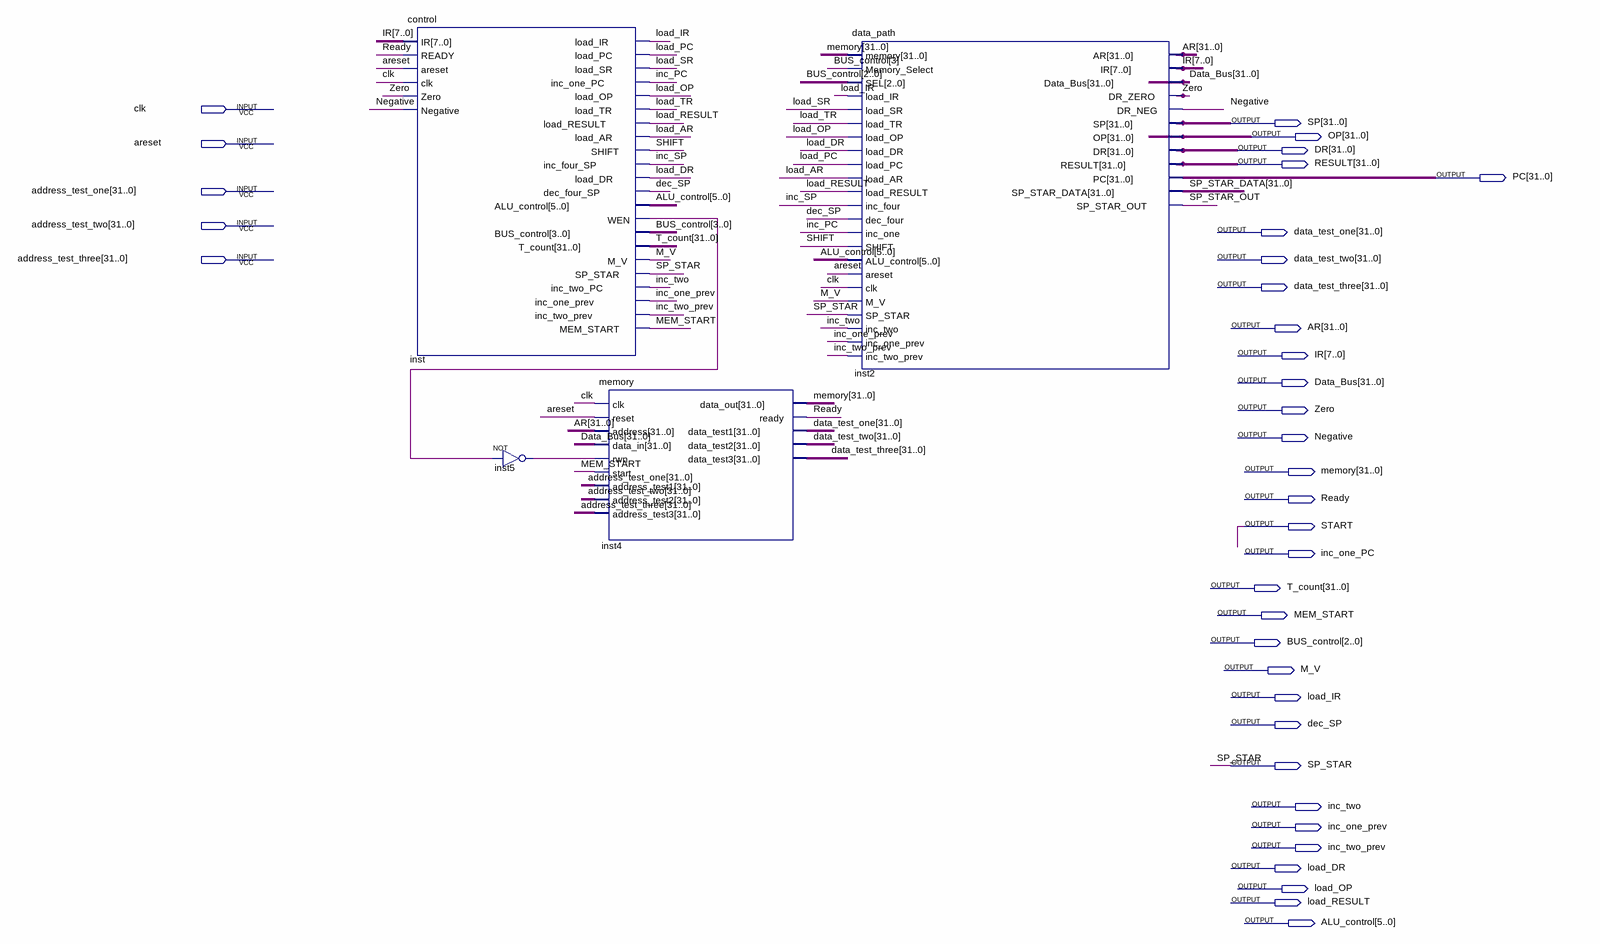
[diagram p0: schematic sheet]
// Quartus schematic CPU.bdf as structural Verilog: 4 symbols, 36 pins
module CPU (
  input  clk,
  input  areset,
  input  [31:0] address_test_one,
  input  [31:0] address_test_two,
  input  [31:0] address_test_three,
  output [31:0] SP,
  output [31:0] OP,
  output [31:0] DR,
  output [31:0] RESULT,
  output [31:0] PC,
  output [31:0] data_test_one,
  output [31:0] data_test_two,
  output [31:0] data_test_three,
  output [31:0] AR,
  output [7:0] IR,
  output [31:0] Data_Bus,
  output Zero,
  output Negative,
  output [31:0] memory,
  output Ready,
  output START,
  output inc_one_PC,
  output [31:0] T_count,
  output MEM_START,
  output [3:0] BUS_control,
  output M_V,
  output load_IR,
  output dec_SP,
  output SP_STAR,
  output inc_two,
  output inc_one_prev,
  output inc_two_prev,
  output load_DR,
  output load_OP,
  output load_RESULT,
  output [5:0] ALU_control
);

  wire inc_PC, inc_SP, inst5_out, inst_wen, load_AR, load_PC, load_SR, load_TR, SHIFT, SP_STAR_OUT;
  wire [31:0] SP_STAR_DATA;

  control inst (
    .IR(IR), .READY(Ready), .areset(areset), .clk(clk), .Zero(Zero), .Negative(Negative), .load_IR(load_IR),
    .load_PC(load_PC), .load_SR(load_SR), .inc_one_PC(inc_PC), .load_OP(load_OP), .load_TR(load_TR),
    .load_RESULT(load_RESULT), .load_AR(load_AR), .SHIFT(SHIFT), .inc_four_SP(inc_SP), .load_DR(load_DR),
    .dec_four_SP(dec_SP), .ALU_control(ALU_control), .WEN(inst_wen), .BUS_control(BUS_control),
    .T_count(T_count), .M_V(M_V), .SP_STAR(SP_STAR), .inc_two_PC(inc_two), .inc_one_prev(inc_one_prev),
    .inc_two_prev(inc_two_prev), .MEM_START(MEM_START));
  not inst5 (inst5_out, inst_wen);
  memory inst4 (
    .clk(clk), .reset(areset), .address(AR), .data_in(Data_Bus), .rwn(inst5_out), .start(MEM_START),
    .address_test1(address_test_one), .address_test2(address_test_two), .address_test3(address_test_three),
    .data_out(memory), .ready(Ready), .data_test1(data_test_one), .data_test2(data_test_two),
    .data_test3(data_test_three));
  data_path inst2 (
    .memory(memory), .Memory_Select(BUS_control[3]), .SEL(BUS_control[2:0]), .load_IR(load_IR),
    .load_SR(load_SR), .load_TR(load_TR), .load_OP(load_OP), .load_DR(load_DR), .load_PC(load_PC),
    .load_AR(load_AR), .load_RESULT(load_RESULT), .inc_four(inc_SP), .dec_four(dec_SP), .inc_one(inc_PC),
    .SHIFT(SHIFT), .ALU_control(ALU_control), .areset(areset), .clk(clk), .M_V(M_V), .SP_STAR(SP_STAR),
    .inc_two(inc_two), .inc_one_prev(inc_one_prev), .inc_two_prev(inc_two_prev), .AR(AR), .IR(IR),
    .Data_Bus(Data_Bus), .DR_ZERO(Zero), .DR_NEG(Negative), .SP(SP), .OP(OP), .DR(DR), .RESULT(RESULT),
    .PC(PC), .SP_STAR_DATA(SP_STAR_DATA), .SP_STAR_OUT(SP_STAR_OUT));
endmodule
